# Altium schematic sheet Radio.SchDoc
size A4; SheetNumber: 7; SheetTotal: 7
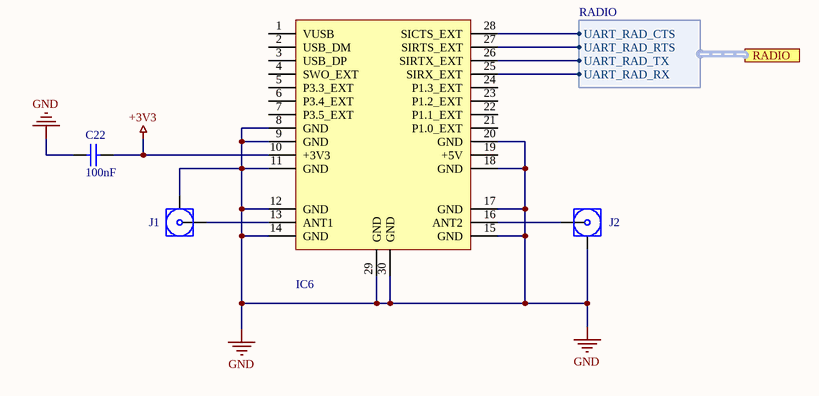
[diagram p0: Radio.SchDoc]

## Parts
C22  value 100nF  [CAPC1608X10N]  (hidden comment: C0603C104M5RACTU)
IC6  RFD900ux  [RFD900ux-Footprint-1]  (value not drawn)
J1  PCB.SMAFST.J.A.HT  [PCB.SMAFST.J.A.HT-Footprint-1]  (value not drawn)
J2  PCB.SMAFST.J.A.HT  [PCB.SMAFST.J.A.HT-Footprint-1]  (value not drawn)

## Ports
RADIO (harness RADIO, see Top Level[2D], Flight_Computer[4B])

## Harnesses
RADIO: UART_RAD_CTS, UART_RAD_RTS, UART_RAD_TX, UART_RAD_RX

## Nets
+3V3: C22.2 IC6.10(+3V3)
GND: C22.1 IC6.8(GND) IC6.9(GND) IC6.11(GND) IC6.12(GND) IC6.14(GND) IC6.15(GND) IC6.17(GND) IC6.18(GND) IC6.20(GND) IC6.29(GND) IC6.30(GND) J1.2(GND) J2.2(GND)
NetIC6_13: IC6.13(ANT1) J1.1(SIG)
NetIC6_16: IC6.16(ANT2) J2.1(SIG)
NetIC6_25: IC6.25(SIRX_EXT) ; port RADIO.UART_RAD_RX
NetIC6_26: IC6.26(SIRTX_EXT) ; port RADIO.UART_RAD_TX
NetIC6_27: IC6.27(SIRTS_EXT) ; port RADIO.UART_RAD_RTS
NetIC6_28: IC6.28(SICTS_EXT) ; port RADIO.UART_RAD_CTS

Not connected (* = marked no-connect by the designer): IC6 1(VUSB) 2(USB_DM) 3(USB_DP) 4(SWO_EXT) 5(P3.3_EXT) 6(P3.4_EXT) 7(P3.5_EXT) 19(+5V) 21(P1.0_EXT) 22(P1.1_EXT) 23(P1.2_EXT) 24(P1.3_EXT)

## Library data of the parts
C22 = CMP-00038-5: Cap Ceramic 0.1uF 50V X7R 20% SMD 0603 125C T/R; Dissipation Factor: 2.5%; Dielectric Material: Ceramic; Voltage Rating: 50V; Lead Pitch: 0.7mm; Package Quantity: 1; Case Code (Metric): 1608; Tolerance: 20%; Termination: SMD/SMT; Min Operating Temperature: -55°C; Height: 0.8mm; Voltage Rating (DC): 50V; Contact Plating: Tin,Matte; Case/Package: 0603; Capacitance: 100nF; Length: 1.6mm; Dielectric: X7R; Depth: 0.8mm; Mount: Surface Mount,PCB; Thickness: 0.034inch; Width: 0.031inch; REACH SVHC: No SVHC; Packaging: Tape and Reel; Case Code (Imperial): 0603; Max Operating Temperature: 125°C; Radiation Hardening: No; JLC_PN: C14663
IC6 = CMP-00019-3: Long range surface mount radio module 902-928Mhz
J1 J2 = CMP-00234-3: CONN SMA JACK STR 50OHM PCB; Impedance: 50R; Body Plating: Gold; Polarity: Standard; Operating Frequency: 0 to 12.4 GHz; Max Frequency: 12.4GHz; Insulation Resistance: 5GR; Voltage Rating: 335V; Dielectric Material: PTFE; Body Material: Brass; Connector Type: SMA; Plating: Gold; Mount: Surface Mount; Center Contact Plating: Gold; Frequency: 12.4GHz; Series: -; Case/Package: SMA; Contact Material: Bronze; Fastening Type: Threaded; Housing Color: Gold; Packaging: Tray; Contact Plating: Gold; Orientation: Straight; Package Quantity: 500; Termination: Solder